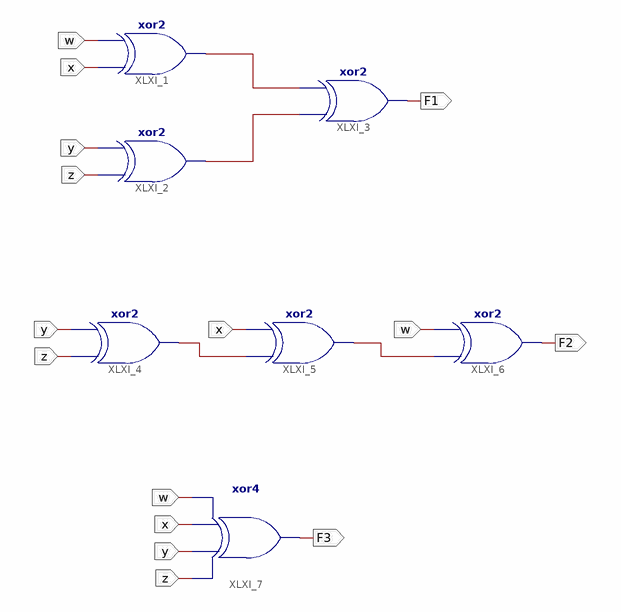
[diagram p0: schematic sheet 1]
// Xilinx ISE schematic scha.sch (artix7) as structural Verilog: 7 symbols, 7 ports
module scha (
  input  w,
  input  x,
  input  y,
  input  z,
  output F1,
  output F2,
  output F3
);

  wire XLXN_5, XLXN_6, XLXN_15, XLXN_16;

  xor XLXI_1 (XLXN_5, x, w);
  xor XLXI_2 (XLXN_6, z, y);
  xor XLXI_3 (F1, XLXN_6, XLXN_5);
  xor XLXI_4 (XLXN_15, z, y);
  xor XLXI_5 (XLXN_16, XLXN_15, x);
  xor XLXI_6 (F2, XLXN_16, w);
  xor XLXI_7 (F3, z, y, x, w);
endmodule
